# EAGLE design versao4.0 (EAGLE 7.7.0)
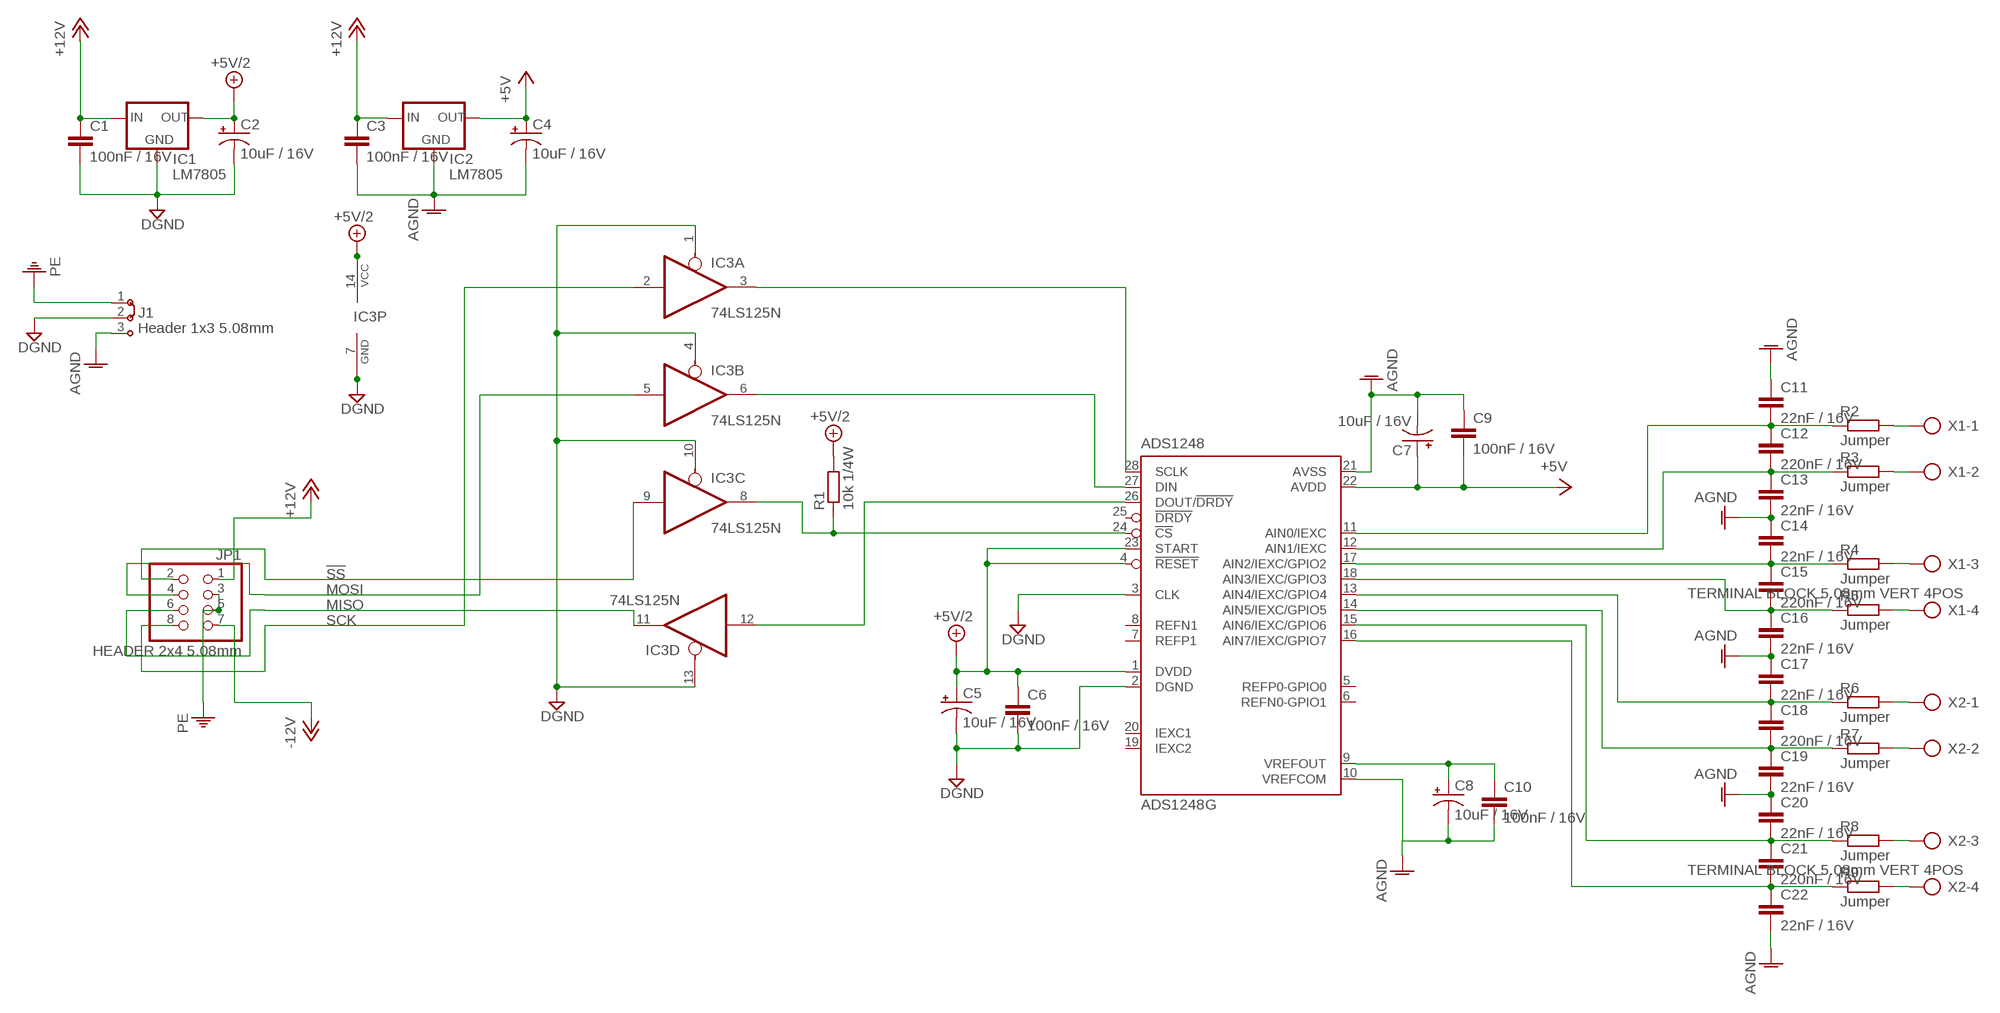
[diagram p0: schematic, sheet 1]

## Parts
C1  100nF / 16V  C5/3  [C5B3]
C2  10uF / 16V  CPOL-USE2-5  [E2-5]
C3  100nF / 16V  C5/3  [C5B3]
C4  10uF / 16V  CPOL-USE2-5  [E2-5]
C5  10uF / 16V  CPOL-USE2-5  [E2-5]
C6  100nF / 16V  C5/3  [C5B3]
C7  10uF / 16V  CPOL-USE2-5  [E2-5]
C8  10uF / 16V  CPOL-USE2-5  [E2-5]
C9  100nF / 16V  C5/3  [C5B3]
C10  100nF / 16V  C5/3  [C5B3]
C11  22nF / 16V  C5/2.5  [C5B2.5]
C12  220nF / 16V  C5/2.5  [C5B2.5]
C13  22nF / 16V  C5/2.5  [C5B2.5]
C14  22nF / 16V  C5/2.5  [C5B2.5]
C15  220nF / 16V  C5/2.5  [C5B2.5]
C16  22nF / 16V  C5/2.5  [C5B2.5]
C17  22nF / 16V  C5/2.5  [C5B2.5]
C18  220nF / 16V  C5/2.5  [C5B2.5]
C19  22nF / 16V  C5/3  [C5B3]
C20  22nF / 16V  C5/2.5  [C5B2.5]
C21  220nF / 16V  C5/2.5  [C5B2.5]
C22  22nF / 16V  C5/2.5  [C5B2.5]
IC1  LM7805  78XXL  [78XXL]
IC2  LM7805  78XXL  [78XXL]
IC3  74LS125N  [DIL14]
IC4  ADS1248G  [P-TSSOP28-1]
J1  Header 1x3 5.08mm  J2X2MM  [04C]
JP1  HEADER 2x4 5.08mm  PINHD-2X4  [2X04]
R1  10k 1/4W  R-EU_0204/7  [0204/7]
R2  Jumper  R-EU_0204/7  [0204/7]
R3  Jumper  R-EU_0204/7  [0204/7]
R4  Jumper  R-EU_0204/7  [0204/7]
R5  Jumper  R-EU_0204/7  [0204/7]
R6  Jumper  R-EU_0204/7  [0204/7]
R7  Jumper  R-EU_0204/7  [0204/7]
R8  Jumper  R-EU_0204/7  [0204/7]
R9  Jumper  R-EU_0204/7  [0204/7]
X1  TERMINAL BLOCK 5.08mm VERT 4POS  AK500/4-H  [AK500/4-H]
X2  TERMINAL BLOCK 5.08mm VERT 4POS  AK500/4-H  [AK500/4-H]

## Nets
!SS: IC3.9(C:I) JP1.2
+5V: C4.+ C7.+ C9.2 IC2.OUT IC4.22(AVDD)
+5V/2: C2.+ C5.+ C6.1 IC1.OUT IC3.14(P:VCC) IC4.1(DVDD) IC4.4(!RESET) IC4.23(START) R1.2
+12V: C1.1 C3.1 IC1.IN IC2.IN JP1.1
-12V: JP1.7
AGND: C3.2 C4.- C7.- C8.- C9.1 C10.2 C11.1 C13.2 C14.1 C16.2 C17.1 C19.2 C20.1 C22.2 IC2.GND IC4.10(VREFCOM) IC4.21(AVSS) J1.3
DGND: C1.2 C2.- C5.- C6.2 IC1.GND IC3.1(A:OE) IC3.4(B:OE) IC3.7(P:GND) IC3.10(C:OE) IC3.13(D:OE) IC4.2(DGND) IC4.3(CLK) J1.2
MISO: IC3.11(D:O) JP1.6
MOSI: IC3.5(B:I) JP1.4
N$1: C8.+ C10.1 IC4.9(VREFOUT)
N$2: C11.2 C12.1 IC4.11(AIN0/IEXC) R2.1
N$3: C12.2 C13.1 IC4.12(AIN1/IEXC) R3.1
N$4: R3.2 X1.2
N$5: IC3.3(A:O) IC4.28(SCLK)
N$6: R9.2 X2.4
N$7: C17.2 C18.1 IC4.13(AIN4/IEXC/GPIO4) R6.1
N$8: C20.2 C21.1 IC4.15(AIN6/IEXC/GPIO6) R8.1
N$9: C18.2 C19.1 IC4.14(AIN5/IEXC/GPIO5) R7.1
N$10: C15.2 C16.1 IC4.18(AIN3/IEXC/GPIO3) R5.1
N$11: IC3.6(B:O) IC4.27(DIN)
N$12: IC3.12(D:I) IC4.26(DOUT/!DRDY)
N$13: IC3.8(C:O) IC4.24(!CS) R1.1
N$15: R2.2 X1.1
N$16: R8.2 X2.3
N$17: R7.2 X2.2
N$18: R6.2 X2.1
N$19: R5.2 X1.4
N$20: R4.2 X1.3
N$23: C21.2 C22.1 IC4.16(AIN7/IEXC/GPIO7) R9.1
N$24: C14.2 C15.1 IC4.17(AIN2/IEXC/GPIO2) R4.1
PE: J1.1 JP1.3 JP1.5
SCK: IC3.2(A:I) JP1.8
Unconnected: IC4.5(REFP0-GPIO0) IC4.6(REFN0-GPIO1) IC4.7(REFP1) IC4.8(REFN1) IC4.19(IEXC2) IC4.20(IEXC1) IC4.25(!DRDY)

## Library data of the parts
C1 C3 C6 C9-C22 = capacitor-wima:C: CAPACITOR naming: grid - package width
C2 C4 C5 C7 C8 = resistor:CPOL-US: POLARIZED CAPACITOR, American symbol
IC1 IC2 = v-reg:78XXL: VOLTAGE REGULATOR
IC3 = 74xx-us:74*125: Quad bus BUFFER, 3-state
IC4 = mylib:ADS1248: Phase locked loop (PLL), with a multistandard video modulator and a programmable sound FM and AM modulator
J1 = jumper:J2: Jumper switch 2 x 2.5 mm
JP1 = pinhead:PINHD-2X4: PIN HEADER
R1-R9 = resistor:R-EU_: RESISTOR, European symbol
X1 X2 = con-ptr500:AK500/4-H: CONNECTOR Aug. 2004 / PTR Meßtechnik: Die Bezeichnung der Serie AK505 wurde geändert. Es handelt sich hierbei um AK500 in horizontaler Ausführung.

## Board
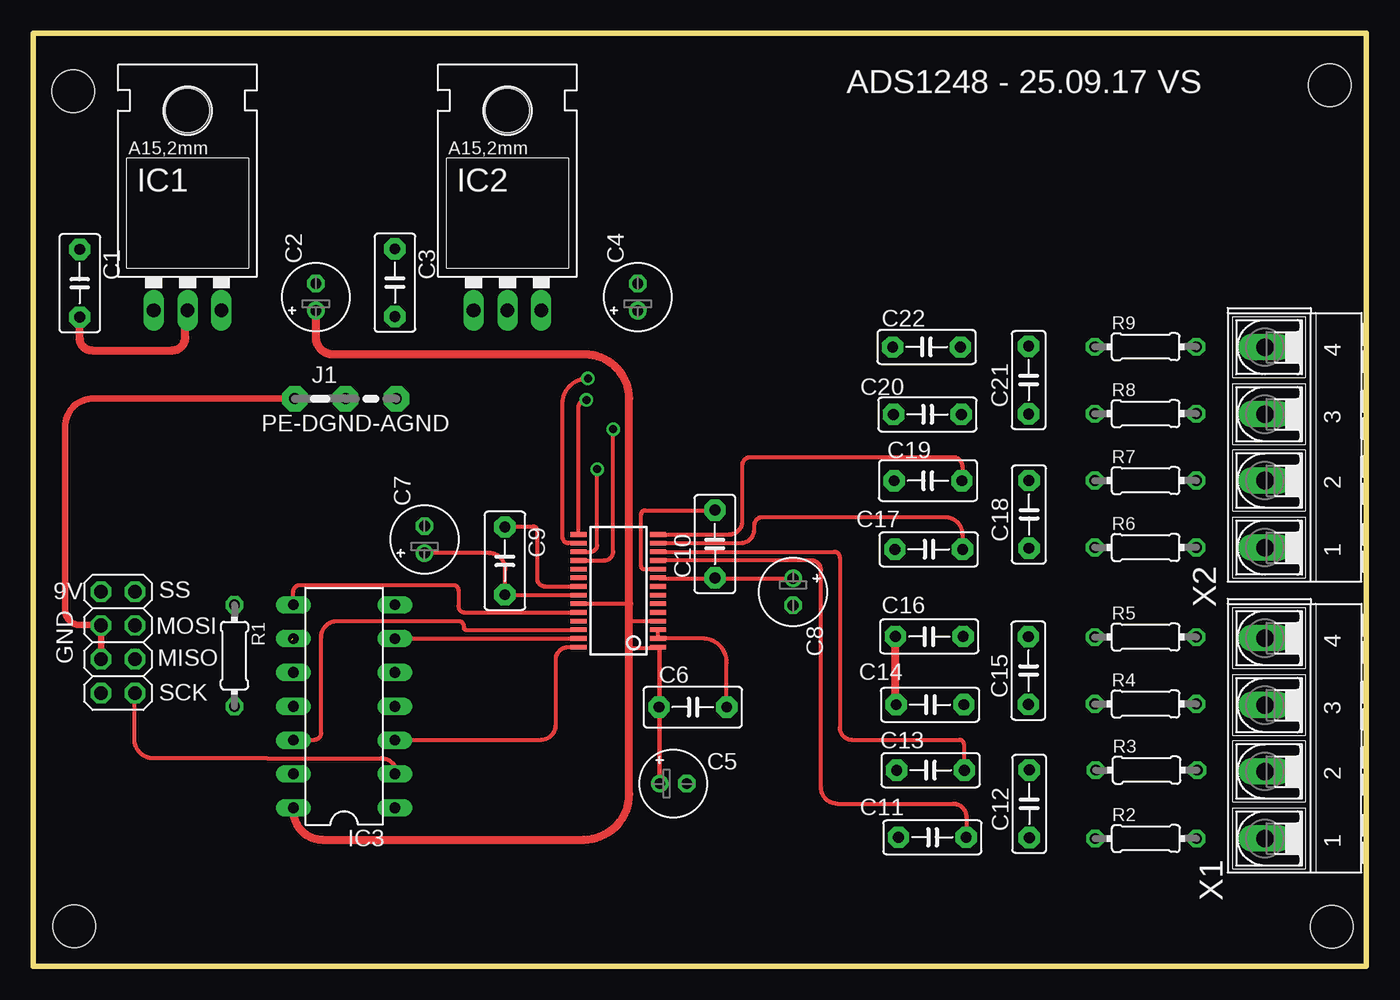
[diagram p1: board, top side]
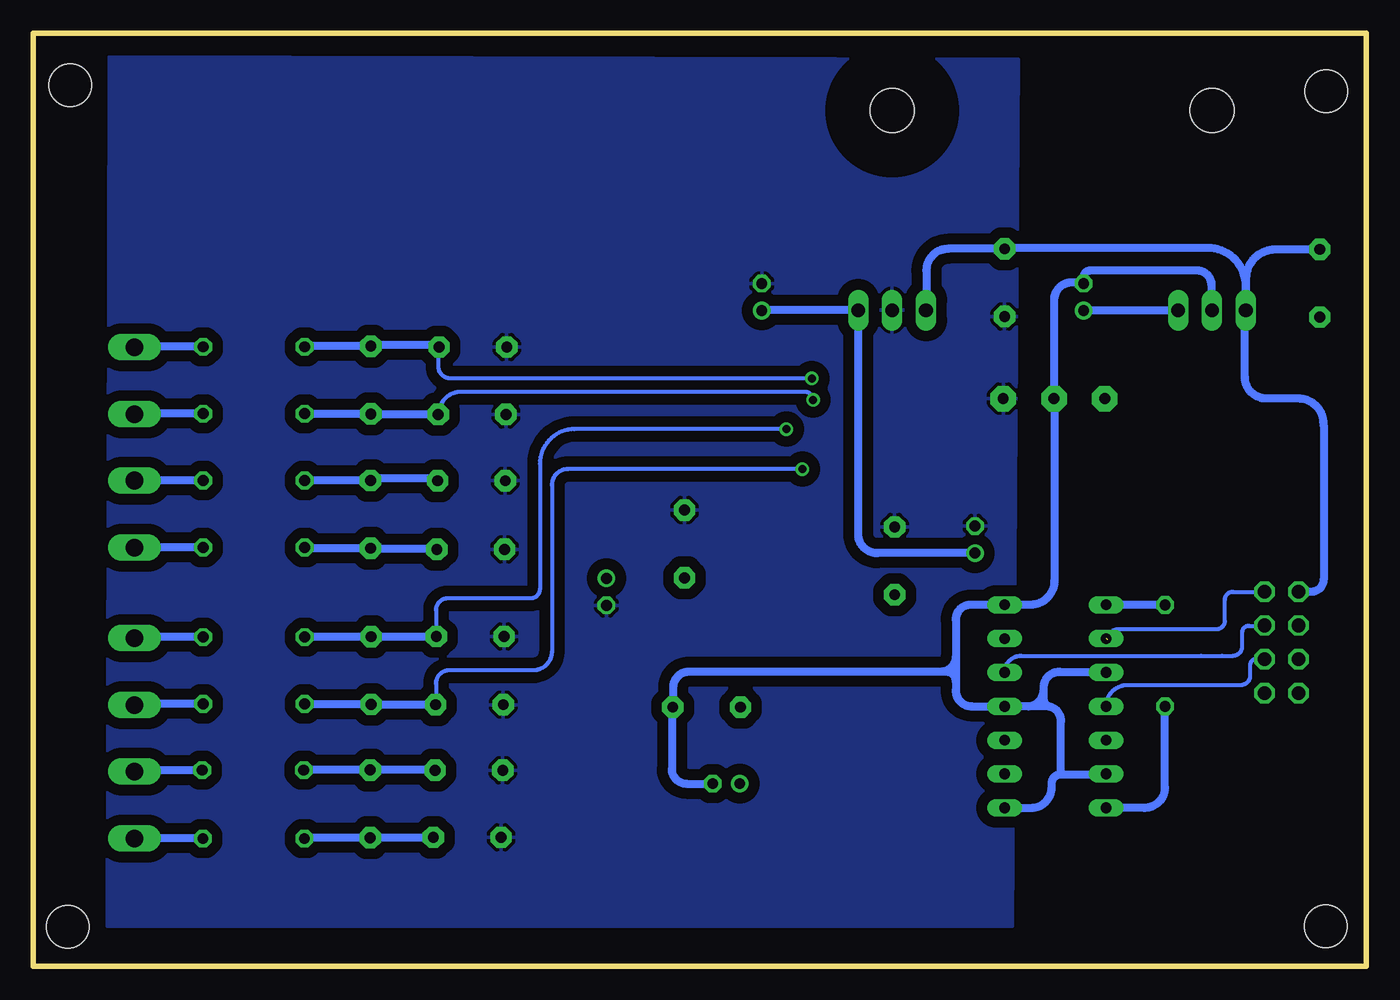
[diagram p2: board, bottom side, seen from below]

Size 100 x 70 mm. Coordinates in mm from the lower left corner, seen from the top.
Outline: 0,0 100,0 100,70 0,70 0,0
Copper layers (1*16): Top 0.035mm / dielectric 1.5mm / Bottom 0.035mm
Design rules "default": minimum track width 10mil, minimum drill 24mil, track to track 8mil, track to pad 8mil, pad to pad 8mil, via to via 8mil, smd to smd 8mil, copper to edge 40mil, drill to drill 8mil, minimum pad ring 10mil, minimum via ring 8mil, stop-mask expansion 4mil, vias tented up to drill 0mil, thermal gap 10mil
Holes 3.2 mm at 97.25,66.1 3.05,3 3,65.65 97.4,2.95

### Footprints (pad centres in the part's own frame; a part is rotated, then mirrored left to right if it is on the bottom)
C5B3 = drill 0.813 pad 1.6 octagon: 1 -2.54,0; 2 2.54,0
E2-5 = drill 0.813 pad 1.27: + -1.016,0 | drill 0.813 pad 1.27 octagon: - 1.016,0
C5B2.5 = drill 0.813 pad 1.6 octagon: 1 -2.54,0; 2 2.54,0
78XXL = drill 1.016 long: GND 0,-3.81; IN -2.54,-3.81; OUT 2.54,-3.81 | hole 3.302: 0,11.176
DIL14 = drill 0.813 long: 1 -7.62,-3.81; 2 -5.08,-3.81; 3 -2.54,-3.81; 4 0,-3.81; 5 2.54,-3.81; 6 5.08,-3.81; 7 7.62,-3.81; 8 7.62,3.81; 9 5.08,3.81; 10 2.54,3.81; 11 0,3.81; 12 -2.54,3.81; 13 -5.08,3.81; 14 -7.62,3.81
P-TSSOP28-1 = smd 0.35 x 1.2: 1 -4.225,-2.975; 2 -3.575,-2.975; 3 -2.925,-2.975; 4 -2.275,-2.975; 5 -1.625,-2.975; 6 -0.975,-2.975; 7 -0.325,-2.975; 8 0.325,-2.975; 9 0.975,-2.975; 10 1.625,-2.975; 11 2.275,-2.975; 12 2.925,-2.975; 13 3.575,-2.975; 14 4.225,-2.975; 15 4.225,2.975; 16 3.575,2.975; 17 2.925,2.975; 18 2.275,2.975; 19 1.625,2.975; 20 0.975,2.975; 21 0.325,2.975; 22 -0.325,2.975; 23 -0.975,2.975; 24 -1.625,2.975; 25 -2.275,2.975; 26 -2.925,2.975; 27 -3.575,2.975; 28 -4.225,2.975
04C = drill 0.813 pad 1.905 octagon: 1 -1.905,0; 2 1.905,0; 3 5.715,0
2X04 = drill 1.016 octagon: 1 -3.81,-1.27; 2 -3.81,1.27; 3 -1.27,-1.27; 4 -1.27,1.27; 5 1.27,-1.27; 6 1.27,1.27; 7 3.81,-1.27; 8 3.81,1.27
0204/7 = drill 0.813 octagon: 1 -3.81,0; 2 3.81,0
AK500/4-H = drill 1.321 long: 1 -7.518,0; 2 -2.489,0; 3 2.489,0; 4 7.518,0

### Placement (x,y rotation side)
C1  3.48,51.25 270 top
C2  21.2,50.21 90 top
C3  27.13,51.29 270 top
C4  45.35,50.21 90 top
C5  48.01,13.7 0 top
C6  49.48,19.44 0 top
C7  29.35,32.01 90 top
C8  57,28.09 270 top
C9  35.38,30.42 270 top
C10  51.14,31.68 90 top
C11  67.45,9.67 0 top
C12  74.72,12.18 90 top
C13  67.32,14.7 180 top
C14  67.28,19.62 0 top
C15  74.66,22.18 90 top
C16  67.22,24.74 180 top
C17  67.18,31.28 0 top
C18  74.7,33.9 90 top
C19  67.13,36.43 180 top
C20  67.08,41.4 0 top
C21  74.68,43.98 90 top
C22  67.02,46.46 180 top
IC1  11.57,53.03 0 top
IC2  35.57,53.03 0 top
IC3  23.32,19.5 90 top
IC4  43.89,28.17 90 top
J1  21.52,42.59 0 top
JP1  6.35,24.3 270 top
R1  15.09,23.3 270 top
R2  83.47,9.58 0 top
R3  83.52,14.71 0 top
R4  83.45,19.68 0 top
R5  83.45,24.7 0 top
R6  83.45,31.42 0 top
R7  83.45,36.44 0 top
R8  83.45,41.46 0 top
R9  83.45,46.48 0 top
X1  92.4,17.1 90 top
X2  92.4,38.93 90 top

### Tracks (layer width: path | path; a pad name or v marks a point on that pad's centre or on a via)
!SS  (1 unrouted)
  Bottom 0.305: 19.38,24.48 arc90 18.56,25.3 13.4,25.3 12.2,25.3 11.2,25.3 arc-90 10.6,25.9 10.6,27.5 arc90 10,28.1 JP1.2 arc-90 JP1.2
+5V
  Top 0.305: C9.2 arc-90 35.4,27.9 | IC4.22 35.45,27.84 arc-90 35.4,27.9 | 35.4,27.9 35.4,29.8 arc90 34.2,31 29.4,31 arc-90 29.2,31.2 arc-90 29.35,31.05 C7.+
  Bottom 0.61: 45.5,49.19 45.5,49.1 | 45.5,49.19 C4.+ | 45.5,49.19 45.5,49.22 IC2.OUT IC2.OUT arc-90 38.1,49.2 38.1,32.4 arc-90 36.69,30.99 C7.+
+5V/2
  Top 0.305: 46.9,23.9 arc-90 46.95,23.95 IC4.1 | 46.9,23.9 arc-90 46.94,23.86 C6.1 46.96,19.44 arc-90 47,19.4 arc90 46.99,19.39 C5.+ 46.99,23.81 arc90 46.9,23.9 | 44.7,27.2 44.6,27.2 arc-90 44.59,27.2 IC4.23 | 44.7,23.9 46.9,23.9 | IC4.4 44.7,25.89 arc-90 44.7,25.9
  Top 0.61: C2.+ 21.2,47.2 arc90 22.5,45.9 41.4,45.9 arc-90 44.7,42.6 44.7,27.2 44.7,25.9 44.7,23.9 44.7,12.9 arc-90 41.3,9.5 21.7,9.5 arc-90 19.5,11.7 arc90 19.51,11.71 IC3.14
  Bottom 0.61: IC1.OUT 21.2,49.22 C2.+ | IC3.14 16.62,11.88 arc-90 15.1,13.4 15.1,19.3 arc-90 15.2,19.4 arc90 15.11,19.49 R1.2
+12V
  Bottom 0.6: 3.2,40.6 3.2,29 arc90 4.1,28.1 JP1.1 arc90 JP1.1
  Bottom 0.61: C1.1 6.81,53.79 arc-90 9,51.6 9,49.3 arc-90 9.03,49.27 IC1.IN | IC2.IN IC2.IN arc90 33,49.2 33,52.2 arc90 31.37,53.83 C3.1 27.17,53.83 arc-90 27.2,53.8 arc90 27.1,53.9 11.9,53.9 arc90 9.03,51.03 IC1.IN | IC1.IN 9.08,49.22 arc-90 9.1,49.2 9.1,44.2 arc-90 7.5,42.6 5.1,42.6 arc90 3.2,40.7 3.2,40.6
AGND
  Top 0.305: IC4.21 38.41,28.5 arc-90 37.8,29.1 37.8,32.7 arc90 37.5,33 35.4,33 arc90 35.38,32.98 C9.1 | IC4.10 45.8,29.8 arc-90 45.6,30 45.6,33.9 arc-90 45.9,34.2 51.1,34.2 arc-90 51.12,34.22 C10.2
  Top 0.61: C14.1 64.74,19.66 arc90 64.7,19.7 arc-90 64.68,19.72 C16.2
  pour Bottom (isolate 0.813): 94.3,68.25 94.45,3 26.55,3 26.1,68.05
DGND
  Top 0.305: 46.9,24.6 arc-90 46.87,24.64 IC4.3 IC4.2 46.9,24.59 arc90 46.9,24.6 | C6.2 52.02,22.78 arc90 50.2,24.6 46.9,24.6
  Top 0.61: C1.2 3.48,47.12 arc90 4.4,46.2 10.4,46.2 arc90 11.4,47.2 11.4,48.7 arc-90 11.8,49.1 arc90 11.68,49.22 IC1.GND
  Bottom 0.61: IC1.GND IC1.GND arc90 11.5,49.3 arc90 11.6,49.4 11.6,51.1 arc-90 12.7,52.2 20.7,52.2 arc-90 21.2,51.7 C2.- 21.23,51.23 arc90 21.3,51.3 22.1,51.3 arc-90 23.43,49.98 J1.2 23.43,42.67 arc90 23.4,42.7 23.4,28.9 arc90 25.18,27.12 IC3.7 29.68,27.12 arc-90 30.8,26 30.8,23.2 | C5.- 51,13.7 arc90 52.1,14.8 52.1,19.3 arc90 52,19.4 arc90 52.02,19.42 C6.2 52.02,19.48 arc90 52,19.5 52,20.9 arc90 50.8,22.1 32.7,22.1 | 30.8,23.2 arc90 31.9,22.1 32.7,22.1 | IC3.1 25.12,11.88 arc-90 23.6,13.4 23.6,13.7 arc90 22.9,14.4 | IC3.13 19.58,14.42 arc-90 19.6,14.4 22.9,14.4 | 25.4,19.5 IC3.4 29.6,19.5 arc90 30.8,20.7 30.8,21.4 | 25.4,19.5 arc-90 24.2,20.7 24.2,20.9 arc90 23,22.1 19.7,22.1 arc90 19.6,22 arc90 19.56,22.04 IC3.10 | 25.4,19.5 24,19.5 arc90 22.9,18.4 22.9,14.4 | 30.8,23.2 30.8,21.4 | 30.8,21.4 arc-90 31.5,22.1 31.7,22.1 32.7,22.1
MISO
  Bottom 0.305: IC3.11 arc90 17.91,21.1 10.7,21.1 9.7,21.1 9.4,21.1 arc-90 8.7,21.8 8.7,22.6 arc90 8.25,23.05 7.64,23.05 arc90 JP1.6
MOSI
  Bottom 0.305: IC3.5 arc90 25.87,23.3 12.4,23.3 10.8,23.3 10,23.3 arc-90 9.3,24 9.3,25.05 arc90 8.8,25.55 7.64,25.55 arc-90 JP1.4
N$1
  Top 0.305: 51.14,29.1 51.2,29.1 | IC4.9 46.97,29.1 51.14,29.1 | C8.+ 51.14,29.1 | 51.14,29.1 C10.1
N$2
  Top 0.305: IC4.11 58.35,30.45 arc-90 59.1,29.7 59.1,13.4 arc90 60.3,12.2 69,12.2 arc-90 70,11.2 70,9.7 arc90 69.99,9.69 C11.2
  Bottom 0.61: R2.1 79.68,9.58 arc90 79.7,9.6 arc90 79.66,9.64 C12.1 70.06,9.64 arc-90 69.9,9.8 arc-90 69.99,9.71 C11.2
N$3
  Top 0.305: IC4.12 60.1,31.09 arc-90 60.5,30.7 60.5,17.9 arc90 61.4,17 69.5,17 arc-90 69.8,16.7 69.8,14.7 arc90 69.9,14.6 arc-90 69.86,14.64 C13.1
  Bottom 0.61: R3.1 arc90 79.68,14.72 C12.2 69.72,14.72 arc90 69.6,14.6 arc-90 69.7,14.7 C13.1 | R3.1
N$4
  Bottom 0.61: X1.2 92.41,14.61 arc90 92.5,14.7 arc90 92.49,14.71 R3.2
N$5
  Top 0.305: IC4.28 40.15,23.95 arc90 39.2,23 39.2,18.1 arc-90 38.1,17 27.3,17 arc90 27.2,16.9 arc90 IC3.3
N$6
  Bottom 0.61: X2.4 92.45,46.45 arc-90 92.5,46.4 arc90 92.42,46.48 R9.2
N$7
  Top 0.305: IC4.13 53.05,31.75 arc90 54.1,32.8 54.1,33.1 arc-90 54.7,33.7 68.4,33.7 arc-90 69.7,32.4 69.7,31.4 arc90 69.8,31.3 arc-90 69.78,31.28 C17.2
  Bottom 0.61: R6.1 79.68,31.42 arc-90 79.7,31.4 arc-90 79.66,31.36 C18.1 74.7,31.3 69.72,31.3 C17.2
N$8  (via drill 0.6)
  Top 0.305: IC4.15 40.91,42.02 arc-90 v41.5,42.5
  Bottom 0.305: v41.5,42.5 arc-90 42.1,43.1 67.9,43.1 arc-90 69.6,41.4
  Bottom 0.61: R8.1 79.56,41.46 arc90 79.5,41.4 arc90 79.46,41.44 C21.1 74.68,41.4 C20.2 69.6,41.4 69.5,41.4
N$9
  Top 0.305: IC4.14 52.2,32.4 arc90 53.2,33.4 53.2,37.6 arc-90 53.8,38.2 69,38.2 arc-90 69.7,37.5 69.7,36.4 arc-90 C19.1
  Bottom 0.61: 79.66,36.44 arc-90 79.7,36.4 arc90 79.66,36.44 | 79.66,36.44 R7.1 | 79.66,36.44 C18.2 74.7,36.6 69.67,36.6 C19.1
N$10  (via drill 0.6)
  Top 0.305: IC4.18 42.84,30.45 arc90 43.5,31.1 v43.5,40.3
  Bottom 0.305: v43.5,40.3 59.4,40.3 arc-90 62,37.7 62,28.3 arc90 62.7,27.6 68.9,27.6 arc-90 69.8,26.7 69.8,24.8 arc-90 69.7,24.7 arc-90 69.74,24.74 C16.1
  Bottom 0.61: R5.1 79.64,24.76 arc90 79.6,24.8 arc-90 79.52,24.72 C15.2 69.88,24.72 arc-90 69.8,24.8 arc90 69.76,24.76 C16.1
N$11
  Top 0.305: IC4.27 41.01,24.59 arc-90 41,24.6 arc-90 40.98,24.58 IC3.6
N$12
  Top 0.305: IC4.26 32.45,25.25 arc-90 32.3,25.4 32.3,25.5 arc90 31.9,25.9 22.8,25.9 arc90 21.6,24.7 21.6,17.5 arc-90 21.1,17 19.5,17 arc-90 19.51,16.99 IC3.12
N$13
  Top 0.305: IC4.24 32.35,26.55 arc-90 31.9,27 31.9,28.2 arc90 31.5,28.6 20,28.6 arc90 19.5,28.1 19.5,27 arc90 19.51,27.01 IC3.8
  Bottom 0.61: IC3.8 19.58,27.12 arc-90 19.6,27.1 arc90 19.59,27.11 R1.1
N$14
  Bottom 0.406: 24.1,20.6 24.1,20.1 arc-90 23.4,19.4
N$15
  Bottom 0.61: X1.1 92.4,9.5 arc-90 92.3,9.4 arc90 92.12,9.58 R2.2
N$16
  Bottom 0.61: X2.3 92.32,41.42 arc90 92.3,41.4 arc90 92.24,41.46 R8.2
N$17
  Bottom 0.61: X2.2 92.4,36.4 arc90 92.36,36.44 R7.2
N$18
  Bottom 0.61: X2.1 X2.1 arc90 92.5,31.3 arc90 92.38,31.42 R6.2
N$19
  Bottom 0.61: X1.4 92.38,24.62 arc-90 92.3,24.7 R5.2
N$20
  Bottom 0.61: X1.3 92.59,19.59 arc90 92.6,19.6 arc90 92.52,19.68 R4.2
N$23  (via drill 0.6)
  Top 0.305: IC4.16 40.16,31.75 arc-90 39.7,32.2 39.7,42.2 arc-90 v41.6,44.1
  Bottom 0.305: v41.6,44.1 68.7,44.1 arc90 69.6,45 69.6,46.4 arc-90 69.7,46.5 arc-90 69.66,46.46 C22.1
  Bottom 0.61: R9.1 79.48,46.48 arc90 79.4,46.4 arc90 79.28,46.52 C21.2 74.68,46.6 69.56,46.6 C22.1
N$24  (via drill 0.6)
  Top 0.305: IC4.17 41.8,31.09 arc90 42.3,31.6 v42.3,37.3
  Bottom 0.305: v42.3,37.3 59.9,37.3 arc-90 61.1,36.1 61.1,23.6 arc90 62.5,22.2 68.8,22.2 arc-90 69.8,21.2 69.8,19.4 arc90 69.82,19.42 C14.2
  Bottom 0.61: R4.1 79.64,19.64 arc-90 79.6,19.6 arc90 79.56,19.64 C15.1 arc90 74.6,19.7 arc-90 74.52,19.62 C14.2
PE
  Top 0.5: J1.1 4.5,42.6 arc90 2.4,40.5 2.4,26.7 arc90 3.5,25.6 5.05,25.6 arc-90 JP1.3 JP1.5
  Top 0.61: J1.1 19.61,42.62 arc-90 19.7,42.7 arc-90 J1.1
SCK
  Top 0.305: IC3.2 27.28,14.42 arc-90 27.3,14.4 arc90 26.1,15.6 17.5,15.6 10.7,15.6 9,15.6 arc-90 7.6,17 7.6,20.47 arc-90 JP1.8

### Text on the board
tNames: ADS1248 - 25.09.17 VS | PE-DGND-AGND | 9V | SS | MOSI | GND | MISO | SCK